# Altium schematic sheet Power Supply.SchDoc
size A4
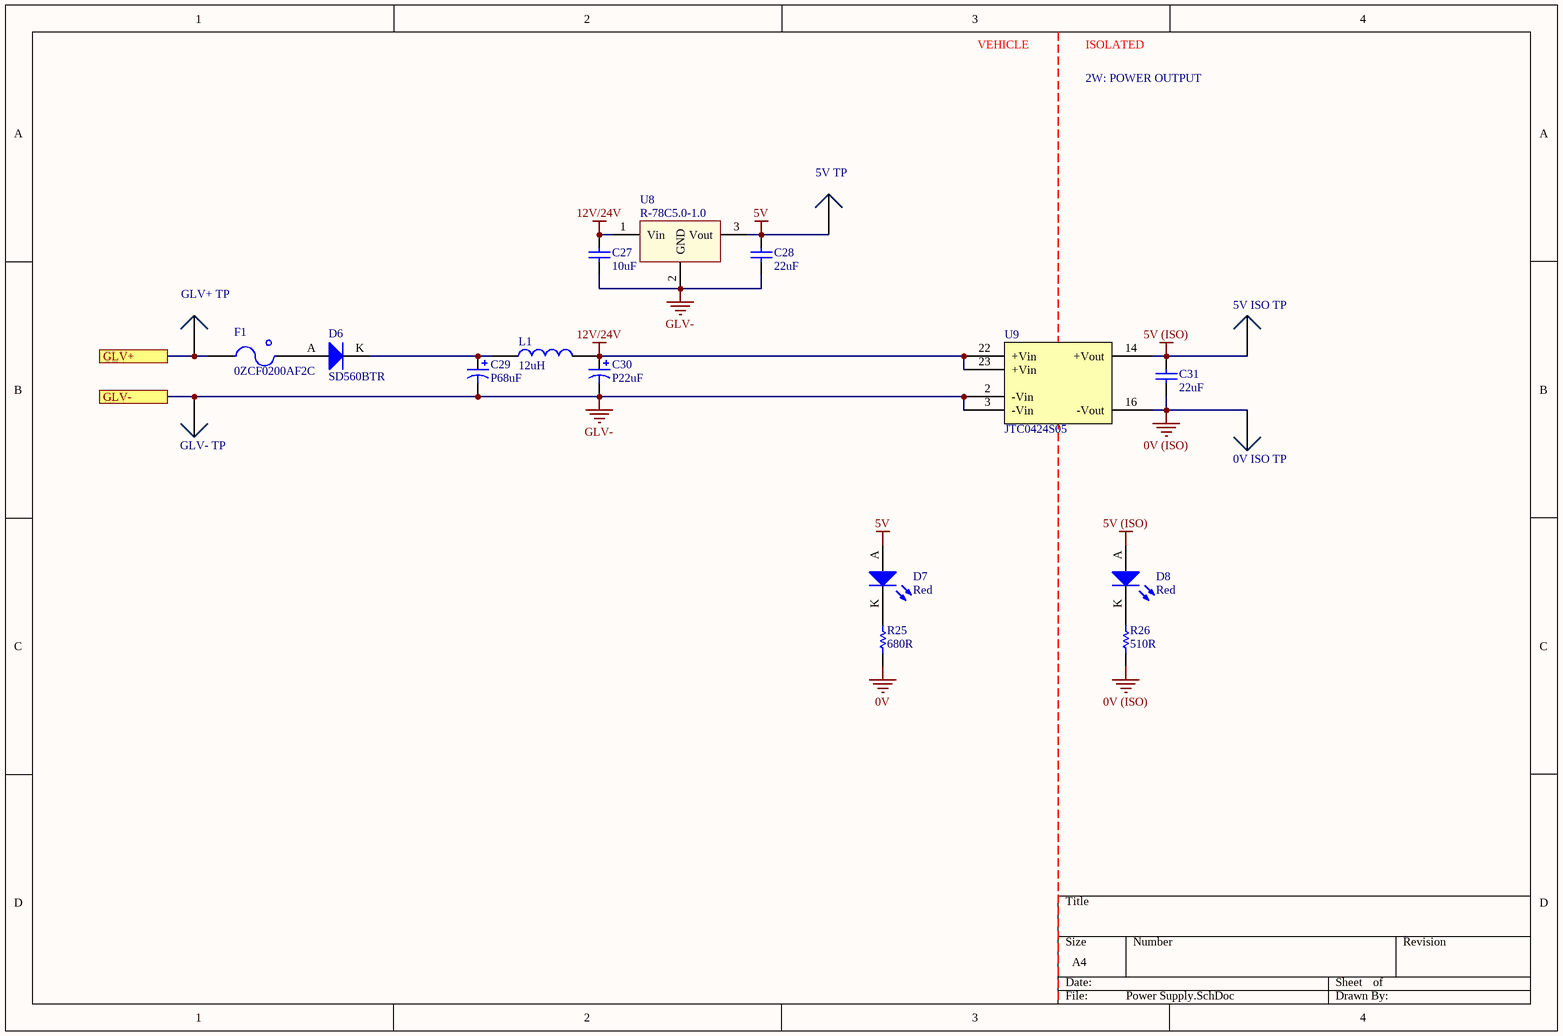
[diagram p0: Power Supply.SchDoc]

## Parts
0V_ISO_TP  0mm  [SMD Test Point]  (value not drawn)
5V_ISO_TP  0mm  [SMD Test Point]  (value not drawn)
5V_TP  0mm  [SMD Test Point]  (value not drawn)
C27  10uF  [0805]
C28  22uF  [1206]
C29  P68uF  [2924]
C30  P22uF  [2924]
C31  22uF  [1206]
D6  SD560BTR  [SMB Diode]
D7  Red  [0805 LED]
D8  Red  [0805 LED]
F1  0ZCF0200AF2C  [2920]
GLV+_TP  0mm  [SMD Test Point]  (value not drawn)
GLV-_TP  0mm  [SMD Test Point]  (value not drawn)
L1  12uH  [1812]
R25  680R  [0805]
R26  510R  [0805]
U8  R-78C5.0-1.0  [RECOM 3-SIP]
U9  JTC0424S05  [24-DIP Module, 7 Leads]

## Ports
GLV+, GLV-

## Nets
0V: R25.1
0V (ISO): 0V_ISO_TP.1 C31.1 R26.1 U9.16(-Vout)
5V: 5V_TP.1 C28.2 D7.A U8.3(Vout)
5V (ISO): 5V_ISO_TP.1 C31.2 D8.A U9.14(+Vout)
12V/24V: C27.2 C30.2 L1.1 U8.1(Vin) U9.22(+Vin) U9.23(+Vin)
GLV-: C27.1 C28.1 C29.1 C30.1 GLV-_TP.1 U8.2(GND) U9.2(-Vin) U9.3(-Vin) ; port GLV-
GLV+: F1.1 GLV+_TP.1 ; port GLV+
NetC29_2: C29.2 D6.K L1.2
NetD6_A: D6.A F1.2
NetD7_K: D7.K R25.2
NetD8_K: D8.K R26.2

## Notes on the sheet
- VEHICLE
- ISOLATED
- 2W: POWER OUTPUT

## Library data of the parts
0V_ISO_TP 5V_ISO_TP 5V_TP GLV+_TP GLV-_TP = SMD Test Point: Positions: 1; Row Spacing: 0; Flange: No; Contact: NA; Part Number: SMD Test Point; Pitch: 0mm; Angle: 0
C27 = GRM21BR6YA106KE43L: Manufacturer: muRata; Tolerance: 10%; Material: X5R; Rated Voltage: 50V; Part Number: GRM21BR6YA106KE43L; Value: 10uF; Digikey Part Number: 490-10514-6-ND
C28 C31 = CC1206MKX5R7BB226: Manufacturer: YAGEO; Tolerance: 20%; Material: Ceramic; Rated Voltage: 16V; Part Number: CC1206MKX5R7BB226; Value: 22uF; Digikey Part Number: 311-1997-2-ND
C29 = TAJV686K035RNJ: Manufacturer: AVX Corporation; Value: 68uF; Tolerance: 10%; Material: Tantalum; Rated Voltage: 35V; Part Number: TAJV686K035RNJ; Digikey Part Number: 478-13135-1-ND
C30 = TAJV226K050RNJ: Manufacturer: AVX Corporation; Value: 22uF; Tolerance: 10%; Material: Tantalum; Rated Voltage: 50V; Part Number: TAJV226K050RNJ; Digikey Part Number: 478-5811-1-ND
D6 = SD560BTR: 1.2V_F 600V 5A SMB; Manufacturer: SMC Diode Solutions; Part Number: SD560BTR; Digikey Part Number: 1655-1530-2-ND; Digikey Link: https://www.digikey.com/product-detail/en/smc-diode-solutions/SD560BTR/1655-1530-2-ND/6022620
D7 D8 = SML-210LTT86: Red LED Indication - Discrete 1.75V 0805 (2012 Metric); Manufacturer: ROHM Semiconductor; Part Number: SML-210LTT86; Colour: Red; Digikey Part Number: 511-1286-1-ND; Digikey Link: https://www.digikey.com/product-detail/en/rohm-semiconductor/SML-210LTT86/511-1286-1-ND/637099
F1 = 0ZCF0200AF2C: SMD 24V 2A Fuse; Manufacturer: Bel Fuse Inc; Part Number: 0ZCF0200AF2C; Digikey Part Number: 507-1749-2-ND; Digikey Link: https://www.digikey.com/product-detail/en/bel-fuse-inc/0ZCF0200AF2C/507-1749-2-ND/4156090
L1 = RLS-126: Manufacturer: Recom; Impedence: 230mOhm; Tolerance: 0.2; Material: Wirewound; Rated Current: 800mA; Part Number: RLS-126; Inductance: 12uH; Digikey Part Number: 945-3429-ND
R25 = RC0805FR07680RL: Manufacturer: YAGEO; Tolerance: 0.01; Rated Voltage: 0.125W; Part Number: RC0805FR07680RL; Value: 680R; Material: FR-07; Digikey Part Number: 311-680CRCT-ND
R26 = RC0805FR07510RL: Manufacturer: YAGEO; Tolerance: 0.01; Rated Voltage: 0.125W; Part Number: RC0805FR07510RL; Value: 510R; Material: FR-07; Digikey Part Number: 311-510CRCT-ND
U8 = R-78C5.0-1.0: CONV DC/DC 1A 5V OUT SIP VERT; Manufacturer: Recom; Isolation: Non-Isolated; Part Number: R-78C5.0-1.0; Digikey Part Number: 945-1395-5-ND; Digikey Link: https://www.digikey.com.au/product-detail/en/recom-power/R-78C5.0-1.0/945-1395-5-ND/2652148
U9 = JTC0424S05: DC DC CONVERTER 5V 4W; Manufacturer: XP Power; Input Voltage: 9V-36V; Efficiency: 0.79; Isolation: Isolated; Part Number: JTC0424S05; Output Voltage: 5V; Output Power: 4W; Digikey Part Number: JTC0424S05-ND; Digikey Link: https://www.digikey.com/products/en?keywords=%20JTC0424S05